# EasyEDA schematic Měnič3.json
TITLE: rapoukBoardGen2v0; REV: 0.0; Date: 28-04-24; Sheet: 1/1; Drawn By: Roman Suk; Company: Suk Industries
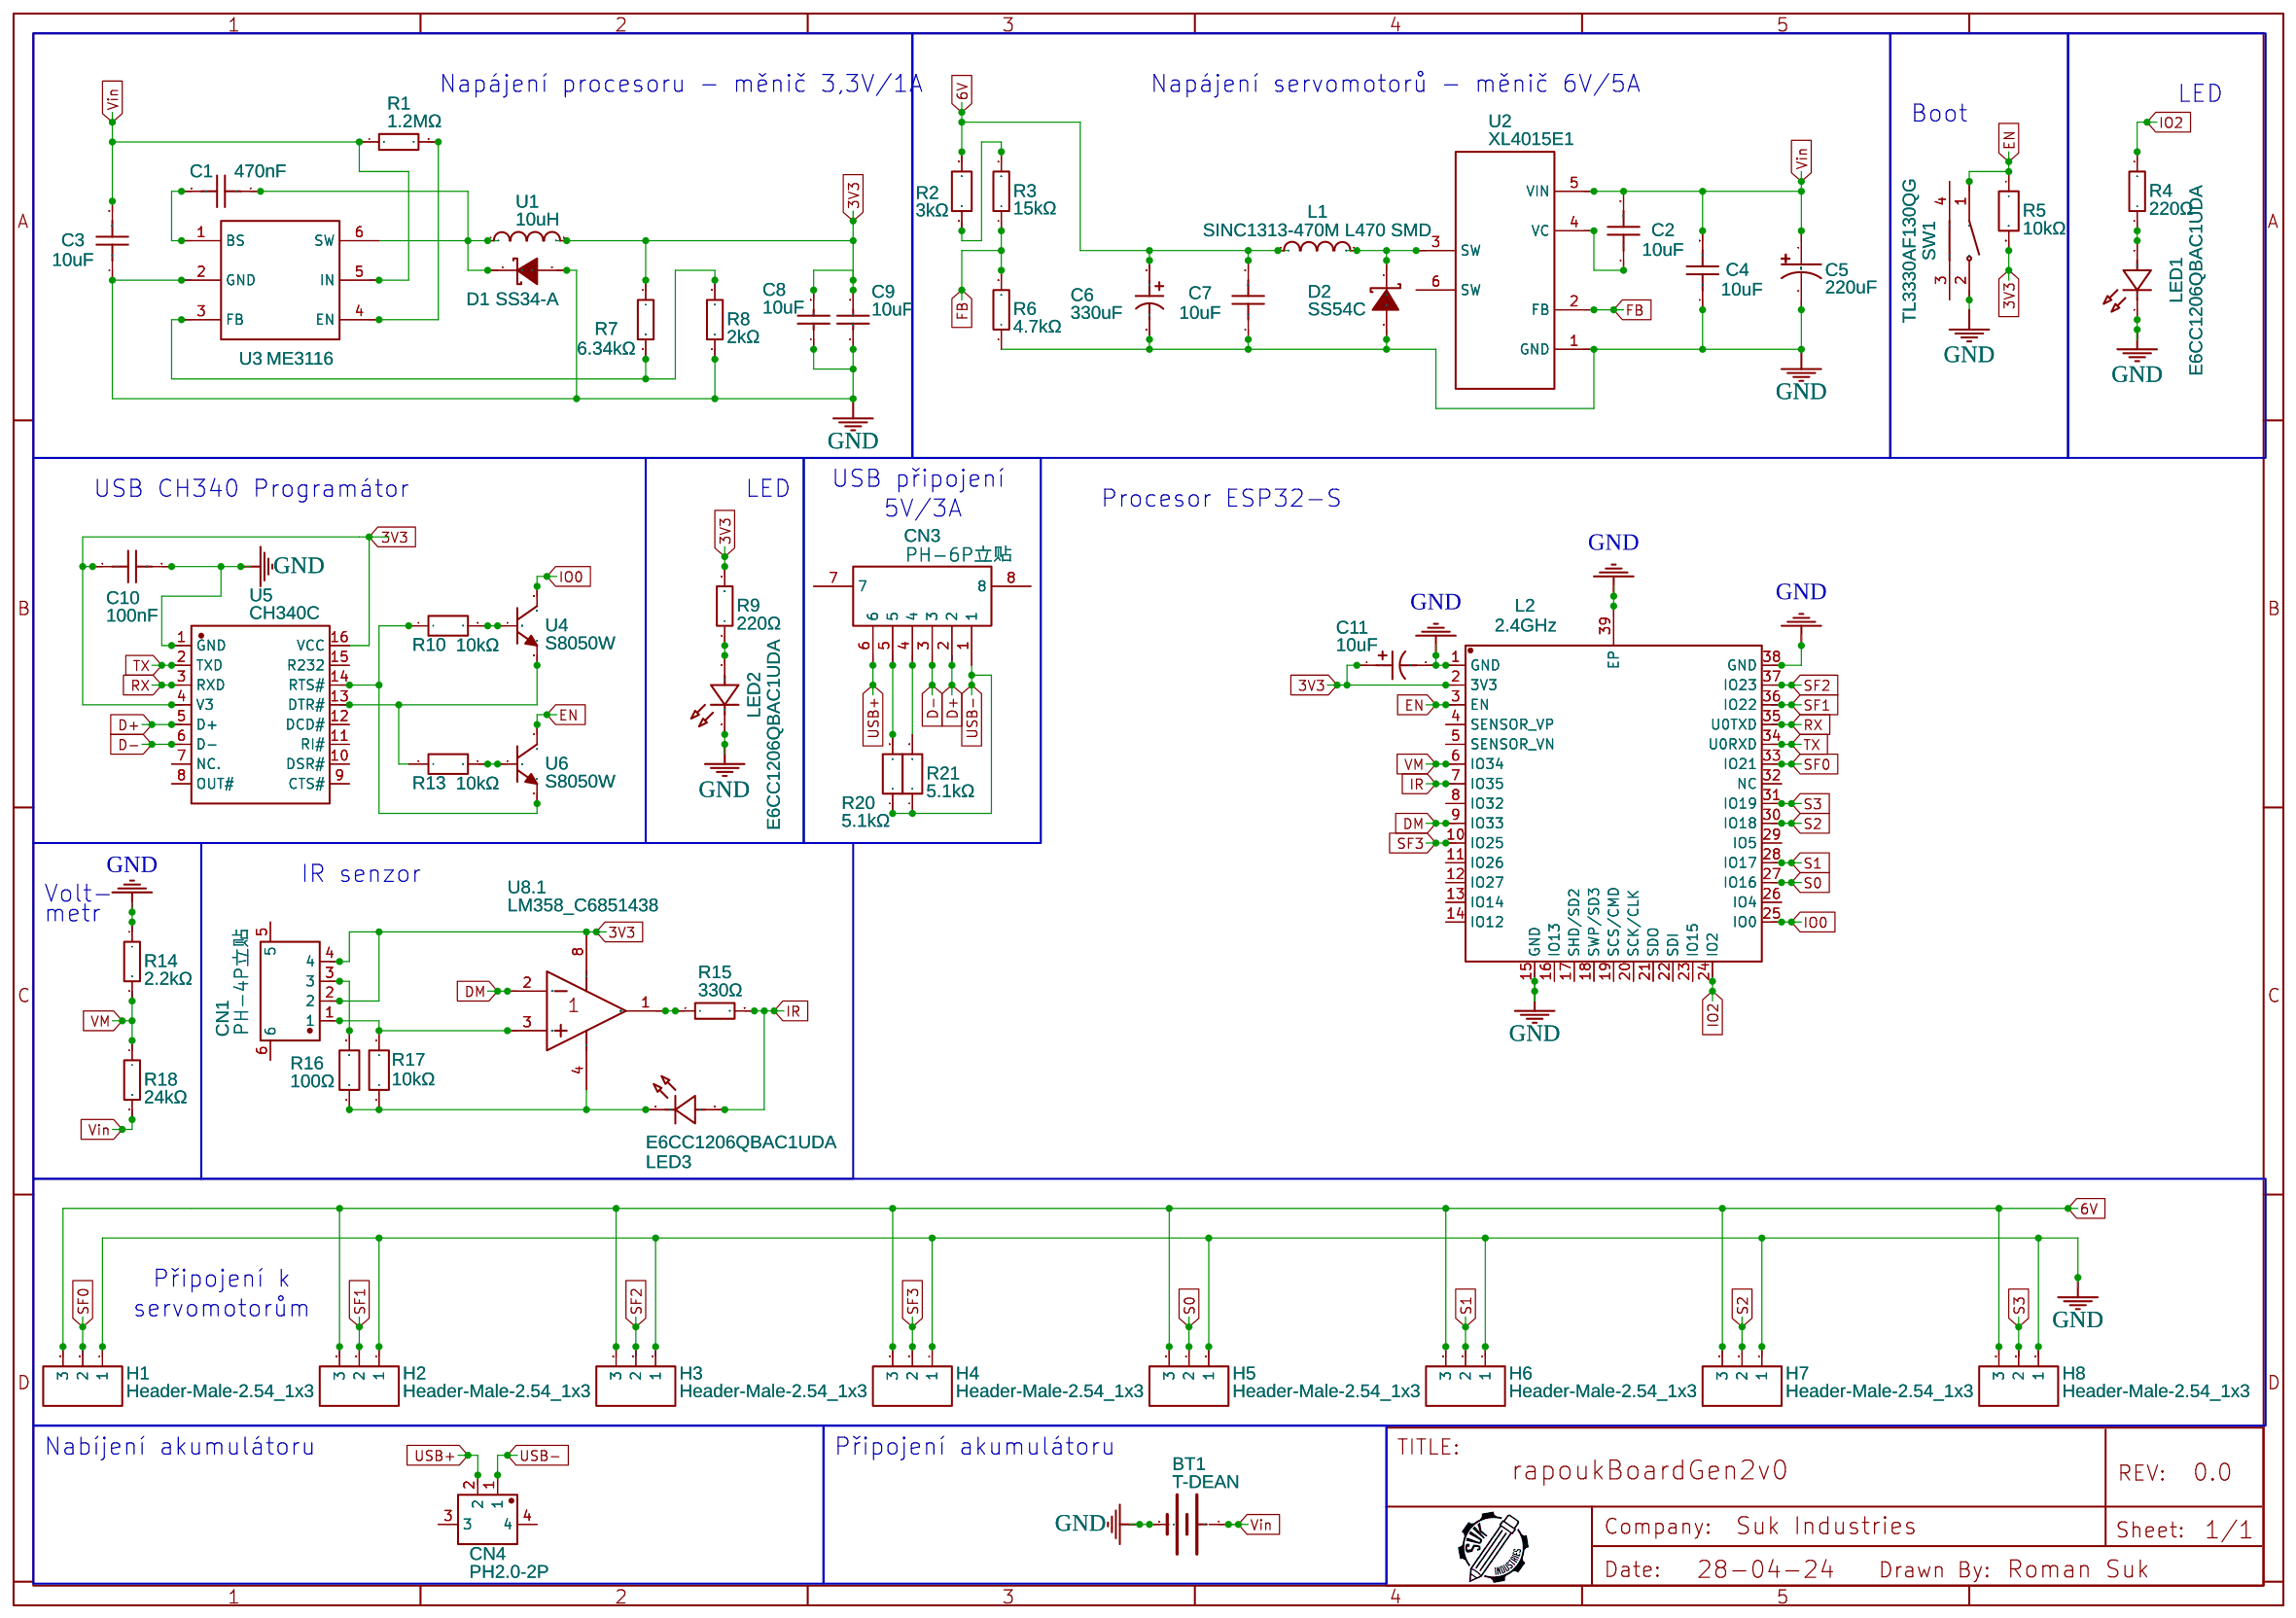
[diagram p0: schematic sheet]

## Parts
BT1  T-DEAN  [T_DEAN]
C1  470nF  [C1206]
C2  10uF  [C1206]
C3  10uF  [C1206]
C4  10uF  [C1206]
C5  220uF  [CAP-SMD_BD10.0-L10.3-W10.3-FD-LS11.0]
C6  330uF  [CAP-SMD_BD6.3-L6.6-W6.6-LS7.6-RD]
C7  10uF  [C1206]
C8  10uF  [C1206]
C9  10uF  [C1206]
C10  100nF  [C1206]
C11  10uF  [CAP-SMD_BD4.0-L4.3-W4.3-FD-LS4.8]
CN1  PH-4P立贴  [CONN-SMD_PH2.0-4P]
CN3  PH-6P立贴  [CONN-SMD_6P-P2.0-L14.0-W5.4]
CN4  PH2.0-2P  [CONN-SMD_PH2.0-1X2PW]
D1  SS34-A  [SMA_L4.3-W2.6-LS5.2-RD]
D2  SS54C  [SMC_L7.5-W5.8-LS8.3-RD]
H1  Header-Male-2.54_1x3  [HDR-TH_3P-P2.54-V-M-1]
H2  Header-Male-2.54_1x3  [HDR-TH_3P-P2.54-V-M-1]
H3  Header-Male-2.54_1x3  [HDR-TH_3P-P2.54-V-M-1]
H4  Header-Male-2.54_1x3  [HDR-TH_3P-P2.54-V-M-1]
H5  Header-Male-2.54_1x3  [HDR-TH_3P-P2.54-V-M-1]
H6  Header-Male-2.54_1x3  [HDR-TH_3P-P2.54-V-M-1]
H7  Header-Male-2.54_1x3  [HDR-TH_3P-P2.54-V-M-1]
H8  Header-Male-2.54_1x3  [HDR-TH_3P-P2.54-V-M-1]
L1  SINC1313-470M L470 SMD  [SINC1313]
L2  2.4GHz  [WIRELM-SMD_ESP32-S]
LED1  E6CC1206QBAC1UDA  [LED1206-RD_BLUE-GH_E6CC1206QBAC1UDA]
LED2  E6CC1206QBAC1UDA  [LED1206-RD_BLUE-GH_E6CC1206QBAC1UDA]
LED3  E6CC1206QBAC1UDA  [LED1206-RD_BLUE-GH_E6CC1206QBAC1UDA]
R1  1.2MΩ  [R1206]
R2  3kΩ  [R1206]
R3  15kΩ  [R1206]
R4  220Ω  [R1206]
R5  10kΩ  [R1206]
R6  4.7kΩ  [R1206]
R7  6.34kΩ  [R1206]
R8  2kΩ  [R1206]
R9  220Ω  [R1206]
R10  10kΩ  [R1206]
R13  10kΩ  [R1206]
R14  2.2kΩ  [R1206]
R15  330Ω  [R1206]
R16  100Ω  [R1206]
R17  10kΩ  [R1206]
R18  24kΩ  [R1206]
R20  5.1kΩ  [R1206]
R21  5.1kΩ  [R1206]
SW1  TL3330AF130QG  [SW-SMD_E-SWITCH_TL3330]
U1  10uH  [IND-SMD_L5.8-W5.2_CD54]
U2  XL4015E1  [TO-263-5_L10.2-W8.9-P1.70-TL]
U3  ME3116  [SOT-23-6_L2.9-W1.6-P0.95-LS2.8-BL]
U4  S8050W  [SOT-323-3_L2.1-W1.3-P1.30-LS2.3-BR]
U5  CH340C  [SOP-16_L10.0-W3.9-P1.27-LS6.0-BL]
U6  S8050W  [SOT-323-3_L2.1-W1.3-P1.30-LS2.3-BR]
U8  LM358_C6851438  [SOP-8_L5.0-W3.9-P1.27-LS6.0-BL]  (section 1)

## Library data of the parts
BT1 = T-DEAN: Contributor: michalklis
C1 = TCC1206X7R474K500FT: Contributor: LCSC; Supplier: LCSC; Supplier Part: C282872; Manufacturer: CCTC(三环); JLCPCB Part Class: Extended Part
C2-C4 C7 = TCC1206X7R106K250HT: Contributor: LCSC; Supplier: LCSC; Supplier Part: C380364; Manufacturer: CCTC(三环); JLCPCB Part Class: Extended Part
C5 = BXJ-50V220-10*10: Contributor: LCSC; Supplier: LCSC; Supplier Part: C165634; Manufacturer: SAMYOUNG(韩国三莹); Manufacturer Part: BXJ50V220M10*10 10TP; JLCPCB Part Class: Extended Part
C6 = 189RV0016: Supplier: LCSC; Supplier Part: C7471878; Manufacturer: KNSCHA(科尼盛); Contributor: lcsc; JLCPCB Part Class: Extended Part
C8 C9 = TMK316B7106KL-TD: Supplier: LCSC; Manufacturer: TAIYO YUDEN(太诱); Supplier Part: C92831; JLCPCB Part Class: Extended Part
C10 = 1206Y1000104KXR: Contributor: LCSC; Supplier: LCSC; Supplier Part: C2319128; Manufacturer: Knowles(楼氏); JLCPCB Part Class: Extended Part
C11 = XT10UF35V90RV0070: Contributor: lcsc; Supplier: LCSC; Supplier Part: C2992602; Manufacturer: KNSCHA(科尼盛); JLCPCB Part Class: Extended Part
CN1 = PH-4P立贴: Contributor: LCSC; Supplier: LCSC; Supplier Part: C67258; Manufacturer: BOOMELE(博穆精密); JLCPCB Part Class: Extended Part
CN3 = PH-6P立贴: Contributor: LCSC; Supplier: LCSC; Supplier Part: C64659; Manufacturer: BOOMELE(博穆精密); JLCPCB Part Class: Extended Part
CN4 = PH2.0-2P: Contributor: LCSC; Supplier: LCSC; Manufacturer: BOOMELE(博穆精密); Manufacturer Part: PH-2P立贴; Supplier Part: C64658; JLCPCB Part Class: Extended Part
D1 = SS34-A: Contributor: LCSC; Supplier: LCSC; Supplier Part: C143201; Manufacturer: FMS(美丽微); JLCPCB Part Class: Extended Part
D2 = SS54C: Contributor: LCSC; Supplier: LCSC; Supplier Part: C330398; Manufacturer: LGE(鲁光); Manufacturer Part: SS54; JLCPCB Part Class: Extended Part
H1-H8 = Header-Male-2.54_1x3: Supplier: LCSC; Manufacturer: BOOMELE(博穆精密); Manufacturer Part: 2.54-1*3P针; Supplier Part: C49257; JLCPCB Part Class: Extended Part
L1 = SINC1313-470M L470 SMD: link: https://vi.aliexpress.com/item/1005006932666277.html?spm=a2g0o.productlist.main.1.240cENmjENmj9N&algo_pvid=bf29db7b-fa88-44d8-ba6d-a49f370a463e&algo_exp_id=bf29db7b-fa88-44d8-ba6d-a49f370a463e-0&pdp_npi=4%40dis%21USD%215.23%214.60%21%21%2137.50%2133.00%21%40210313e917158827587508967e9ebd%2112000038772414878%21sea%21CZ%210%21AB&curPageLogUid=HUxgkZ86eIhu&utparam-url=scene%3Asearch%7Cquery_from%3A; Contributor: romansuk05
L2 = ESP32-S(16MB): Contributor: lcsc; Supplier: LCSC; Supplier Part: C2991923; Manufacturer: Ai-Thinker(安信可); JLCPCB Part Class: Extended Part
LED1-LED3 = E6CC1206QBAC1UDA: Contributor: LCSC; Supplier: LCSC; Supplier Part: C375563; Manufacturer: ekinglux(亿晶源); JLCPCB Part Class: Extended Part
R1 = WR12W1204FTL: Contributor: LCSC; Supplier: LCSC; Manufacturer: Walsin(华新科); Supplier Part: C171052; JLCPCB Part Class: Extended Part
R2 = CR1206J3K00P05Z: Contributor: LCSC; Supplier: LCSC; Supplier Part: C881253; Manufacturer: EVER OHMS(天二科技); JLCPCB Part Class: Extended Part
R3 = RT1206FRD0715KL: Contributor: LCSC; Supplier: LCSC; Manufacturer: YAGEO(国巨); Supplier Part: C136874; JLCPCB Part Class: Extended Part
R4 R9 = AECR1206F220RK9: Contributor: LCSC; Supplier: LCSC; Supplier Part: C352117; Manufacturer: RESI(开步睿思）; JLCPCB Part Class: Extended Part
R5 R10 R13 R17 = SCR1206F10K: Supplier: LCSC; Supplier Part: C3017025; Manufacturer: VO(翔胜); JLCPCB Part Class: Extended Part; Contributor: lcsc
R6 = CRCW12064K70FKEA: Contributor: LCSC; Supplier: LCSC; Supplier Part: C242482; Manufacturer: VISHAY(威世); JLCPCB Part Class: Extended Part
R7 = RS-06K6341FT: Contributor: LCSC; Supplier: LCSC; Supplier Part: C323116; Manufacturer: FH(风华); JLCPCB Part Class: Extended Part
R8 = RTT06202JTP: Supplier: LCSC; Manufacturer: RALEC(旺诠); Supplier Part: C104689; JLCPCB Part Class: Extended Part
R14 = CR1206J40222G: Supplier: LCSC; Manufacturer: LIZ(丽智电子); Supplier Part: C102309; JLCPCB Part Class: Extended Part
R15 = 1206W4F3300T5E: Supplier: LCSC; Manufacturer: UNI-ROYAL(厚声); Supplier Part: C17930; JLCPCB Part Class: Extended Part
R16 = SCR1206F100R: Contributor: lcsc; Supplier: LCSC; Supplier Part: C3017190; Manufacturer: VO(翔胜); JLCPCB Part Class: Extended Part
R18 = CR1206J40243G: Supplier: LCSC; Manufacturer: LIZ(丽智电子); Supplier Part: C102314; JLCPCB Part Class: Extended Part
R20 R21 = RT1206BRD075KL: Supplier: LCSC; Supplier Part: C870818; Manufacturer: YAGEO(国巨); JLCPCB Part Class: Extended Part; Contributor: lcsc
SW1 = TL3330AF130QG: Contributor: LCSC; Supplier: LCSC; Supplier Part: C2886885; Manufacturer: E-Switch; JLCPCB Part Class: Extended Part
U1 = CD54YP0504-100M: Contributor: lcsc; Supplier: LCSC; Supplier Part: C492291; Manufacturer: YJYCOIN(益嘉源); JLCPCB Part Class: Extended Part
U2 = XL4015E1: Supplier: LCSC; Manufacturer: XLSEMI(芯龙); Supplier Part: C51661; JLCPCB Part Class: Extended Part
U3 = ME3116: Supplier: LCSC; Manufacturer: MICRONE(南京微盟); Manufacturer Part: ME3116AM6G; Supplier Part: C97643; JLCPCB Part Class: Extended Part
U4 U6 = S8050W: Contributor: lcsc; Supplier: LCSC; Supplier Part: C5186011; Manufacturer: Slkor(萨科微)
U5 = CH340C: Supplier: LCSC; Manufacturer: WCH(南京沁恒); Supplier Part: C84681; JLCPCB Part Class: Extended Part
U8 = LM358_C6851438: subpart_no: 1; Supplier: LCSC; Supplier Part: C6851438; Manufacturer: HXY MOSFET(华轩阳电子); Manufacturer Part: LM358; JLCPCB Part Class: Extended Part

## Nets
3V3: C8.2 C9.2 C10.1 C11.1 CN1.2 CN1.4 L2.2(3V3) R5.2 R7.1 R9.2 U1.2 U5.4(V3) U5.16(VCC) U8.8(VDD)
6V: C6.1 C7.2 H1.3 H2.3 H3.3 H4.3 H5.3 H6.3 H7.3 H8.3 L1.1 R2.2
GND: BT1.2 C3.1 C4.1 C5.2 C6.2 C7.1 C8.1 C9.1 C10.2 C11.2 D1.2(A) D2.2(A) H1.1 H2.1 H3.1 H4.1 H5.1 H6.1 H7.1 H8.1 L2.1(GND) L2.15(GND) L2.38(GND) L2.39(EP) LED1.1(K) LED2.1(K) R6.1 R8.1 R14.1 SW1.2 U2.1(GND) U3.2(GND) U5.1(GND)
Vin: BT1.1 C2.2 C3.2 C4.2 C5.1 R1.1 R18.2 U2.5(VIN) U3.5(IN)
D+: CN3.2 U5.5(D+)
D-: CN3.3 U5.6(D-)
DM: L2.9(IO33) U8.2(-INA)
EN: L2.3(EN) R5.1 SW1.1 U6.3(C)
FB: R3.1 R6.2 U2.2(FB)
IO0: L2.25(IO0) U4.3(C)
IO2: L2.24(IO2) R4.2
IR: L2.7(IO35) LED3.2(A) R15.2
RX: L2.35(U0TXD) U5.3(RXD)
S0: H5.2 L2.27(IO16)
S1: H6.2 L2.28(IO17)
S2: H7.2 L2.30(IO18)
S3: H8.2 L2.31(IO19)
SF0: H1.2 L2.33(IO21)
SF1: H2.2 L2.36(IO22)
SF2: H3.2 L2.37(IO23)
SF3: H4.2 L2.10(IO25)
TX: L2.34(U0RXD) U5.2(TXD)
USB+: CN3.6 CN4.2
USB-: CN3.1 CN4.1 R20.1 R21.1
VM: L2.6(IO34) R14.2 R18.1
Net-(C1-1): C1.1 D1.1(C) U1.1 U3.6(SW)
Net-(C1-2): C1.2 U3.1(BS)
Net-(C2-1): C2.1 U2.4(VC)
Net-(CN1-1): CN1.1 R17.2 U8.3(+INA)
Net-(CN1-3): CN1.3 R16.2
Net-(CN3-4): CN3.4 R21.2
Net-(CN3-5): CN3.5 R20.2
Net-(D2-1): D2.1(K) L1.2 U2.3(SW)
Net-(LED1-2): LED1.2(A) R4.1
Net-(LED2-2): LED2.2(A) R9.1
Net-(LED3-1): LED3.1(K) R16.1 R17.1 U8.4(VSS)
Net-(R1-2): R1.2 U3.4(EN)
Net-(R2-1): R2.1 R3.2
Net-(R7-2): R7.2 R8.2 U3.3(FB)
Net-(R10-1): R10.1 U5.14(RTS#) U6.2(E)
Net-(R10-2): R10.2 U4.1(B)
Net-(R13-1): R13.1 U4.2(E) U5.13(DTR#)
Net-(R13-2): R13.2 U6.1(B)
Net-(R15-1): R15.1 U8.1(OUTA)

Not connected (* = marked no-connect by the designer): CN1 5 6; CN3 7 8; CN4 3 4; L2 4(SENSOR_VP) 5(SENSOR_VN) 8(IO32) 11(IO26) 12(IO27) 13(IO14) 14(IO12) 16(IO13) 17(SHD/SD2) 18(SWP/SD3) 19(SCS/CMD) 20(SCK/CLK) 21(SDO) 22(SDI) 23(IO15) 26(IO4) 29(IO5) 32(NC); SW1 3 4; U2 6(SW); U5 7(NC.) 8(OUT#) 9(CTS#) 10(DSR#) 11(RI#) 12(DCD#) 15(R232)

## Notes on the sheet
- Napájení procesoru - měnič 3,3V/1A
- Napájení servomotorů - měnič 6V/5A
- LED
- Boot
- USB CH340 Programátor
- LED
- USB připojení
- Procesor ESP32-S
- 5V/3A
- Volt-
- IR senzor
- metr
- Připojení k
- servomotorům
- Nabíjení akumulátoru
- Připojení akumulátoru
